# Altium project FPGA.PrjPCB
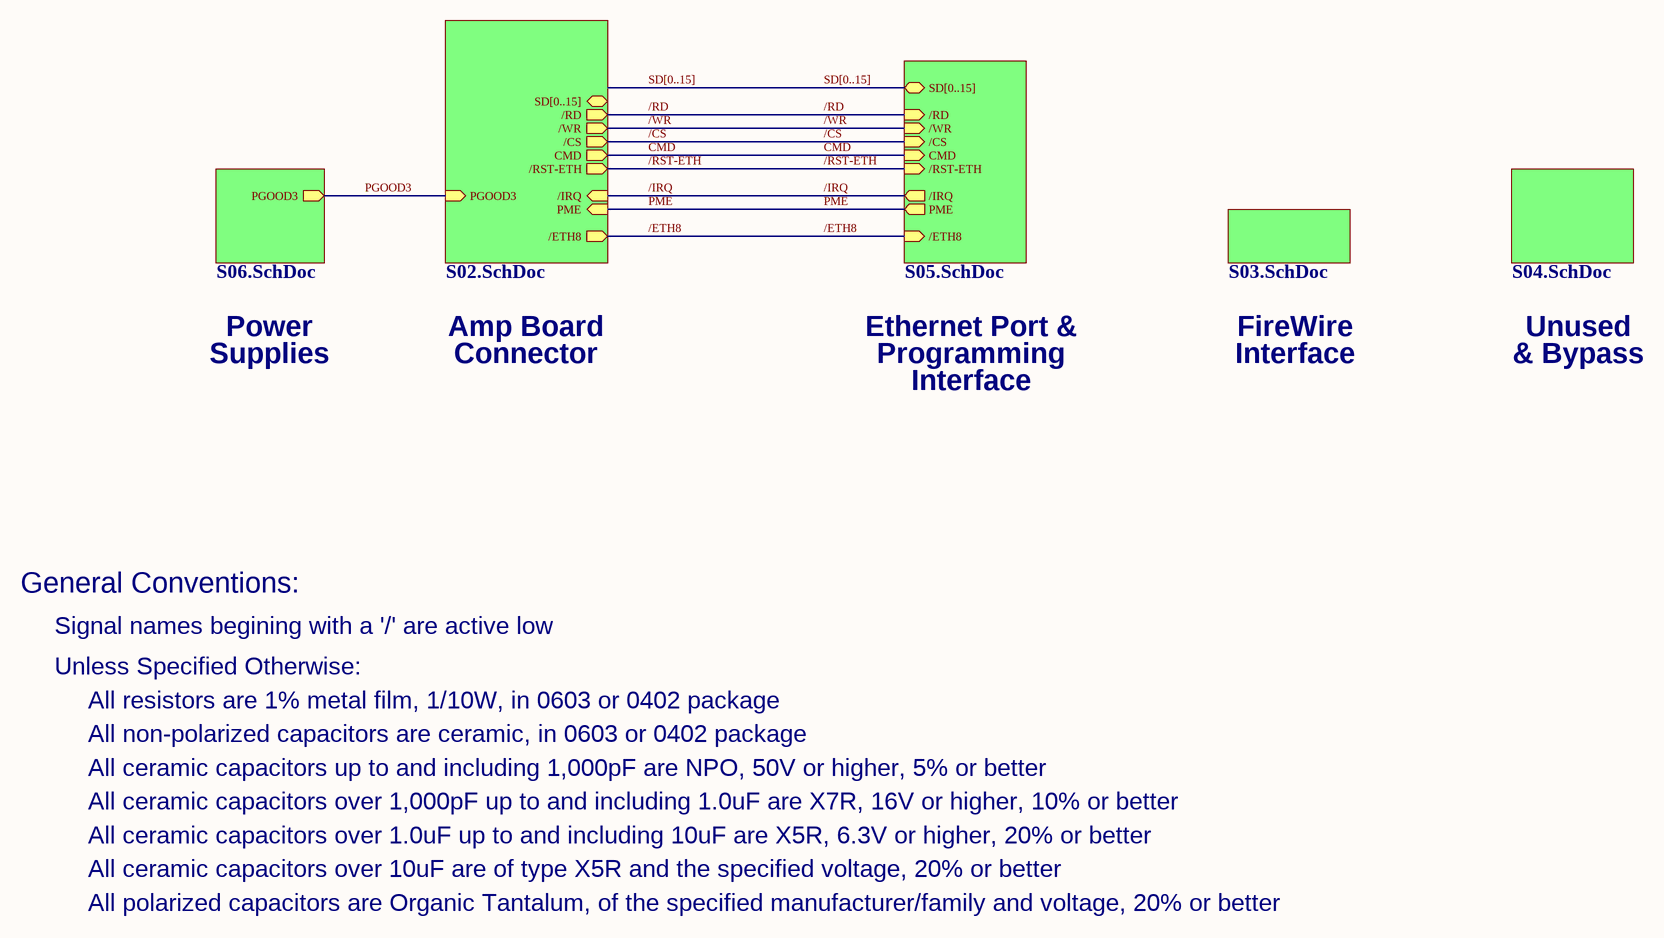
[diagram p0: S01.SchDoc]
6 sheets, 235 parts. Net scope: flat (ports and power ports of the same name join across sheets).
Board file: FPGA.PcbDoc
Sheets:
  S01.SchDoc
    U_S02 = S02.SchDoc
    U_S03 = S03.SchDoc
    U_S04 = S04.SchDoc
    U_S05 = S05.SchDoc
    U_S06 = S06.SchDoc

## Sheet S01.SchDoc: IEEE-1394/Ethernet FPGA Controller
size 381 x 254 mm; Revision: 2.1; SheetNumber: 1; SheetTotal: 6; PageSetup: Record=PageOptions|CenterHorizontal=True|CenterVertical=True|PrintScale=1.08|XCorrection=1.00|YCorrection=1.00|PrintKind=1|BorderSize=5000000|LeftOffset=0|BottomOffset=0|Orientation=2|PaperLength=1000|PaperWidth=1000|Scale=100|PaperSource=7|PrintQuality=600|MediaType=1|DitherType=10|PrintScaleMode=1|PaperKind=Ledger|PaperIndex=3

### Sub-sheets
U_S02 = S02.SchDoc: CMD (out), /IRQ (in), /RD (out), /WR (out), /CS (out), /RST-ETH (out), PME (in), SD[0..15] (bidir), PGOOD3 (in), /ETH8 (out)
U_S03 = S03.SchDoc: no entries
U_S04 = S04.SchDoc: no entries
U_S05 = S05.SchDoc: CMD (in), /IRQ (out), /RD (in), /WR (in), /CS (in), /RST-ETH (in), PME (out), SD[0..15] (bidir), /ETH8 (in)
U_S06 = S06.SchDoc: PGOOD3 (out)

### Nets
/CS: sheet U_S02//CS, sheet U_S05//CS
/ETH8: sheet U_S02//ETH8, sheet U_S05//ETH8
/IRQ: sheet U_S02//IRQ, sheet U_S05//IRQ
/RD: sheet U_S02//RD, sheet U_S05//RD
/RST-ETH: sheet U_S02//RST-ETH, sheet U_S05//RST-ETH
/WR: sheet U_S02//WR, sheet U_S05//WR
CMD: sheet U_S02/CMD, sheet U_S05/CMD
PGOOD3: sheet U_S02/PGOOD3, sheet U_S06/PGOOD3
PME: sheet U_S02/PME, sheet U_S05/PME

### Buses and harness runs
bus SD[0..15] = sheet U_S05/SD[0..15]

### Notes on the sheet
- Power
- Supplies
- Amp Board
- Connector
- Ethernet Port &
- Programming
- FireWire
- Interface
- Unused
- & Bypass
- General Conventions:
- Signal names begining with a '/' are active low
- Unless Specified Otherwise:
- All resistors are 1% metal film, 1/10W, in 0603 or 0402 package
- All non-polarized capacitors are ceramic, in 0603 or 0402 package
- All ceramic capacitors up to and including 1,000pF are NPO, 50V or higher, 5% or better
- All ceramic capacitors over 1,000pF up to and including 1.0uF are X7R, 16V or higher, 10% or better
- All ceramic capacitors over 10uF are of type X5R and the specified voltage, 20% or better
- All polarized capacitors are Organic Tantalum, of the specified manufacturer/family and voltage, 20% or better
- All ceramic capacitors over 1.0uF up to and including 10uF are X5R, 6.3V or higher, 20% or better
- 1
- 2
- 3
- 4
- 5
- A
- B
- C
- Drawing Title:
- D
- E
- Sheet:
- Rev:
- F
- Title:
- Computational
- Sensing + Robotics
- L A B O R A T O R Y   F O R
- Part No:
- Print Date:
- THE JOHNS HOPKINS UNIVERSITY
- h t t p : / / l c s r . j h u . e d u
- File Name:
- Sheet
- of

## Sheet S02.SchDoc: IEEE-1394/Ethernet FPGA Controller
size 381 x 254 mm; Revision: 2.1; SheetNumber: 2; SheetTotal: 6
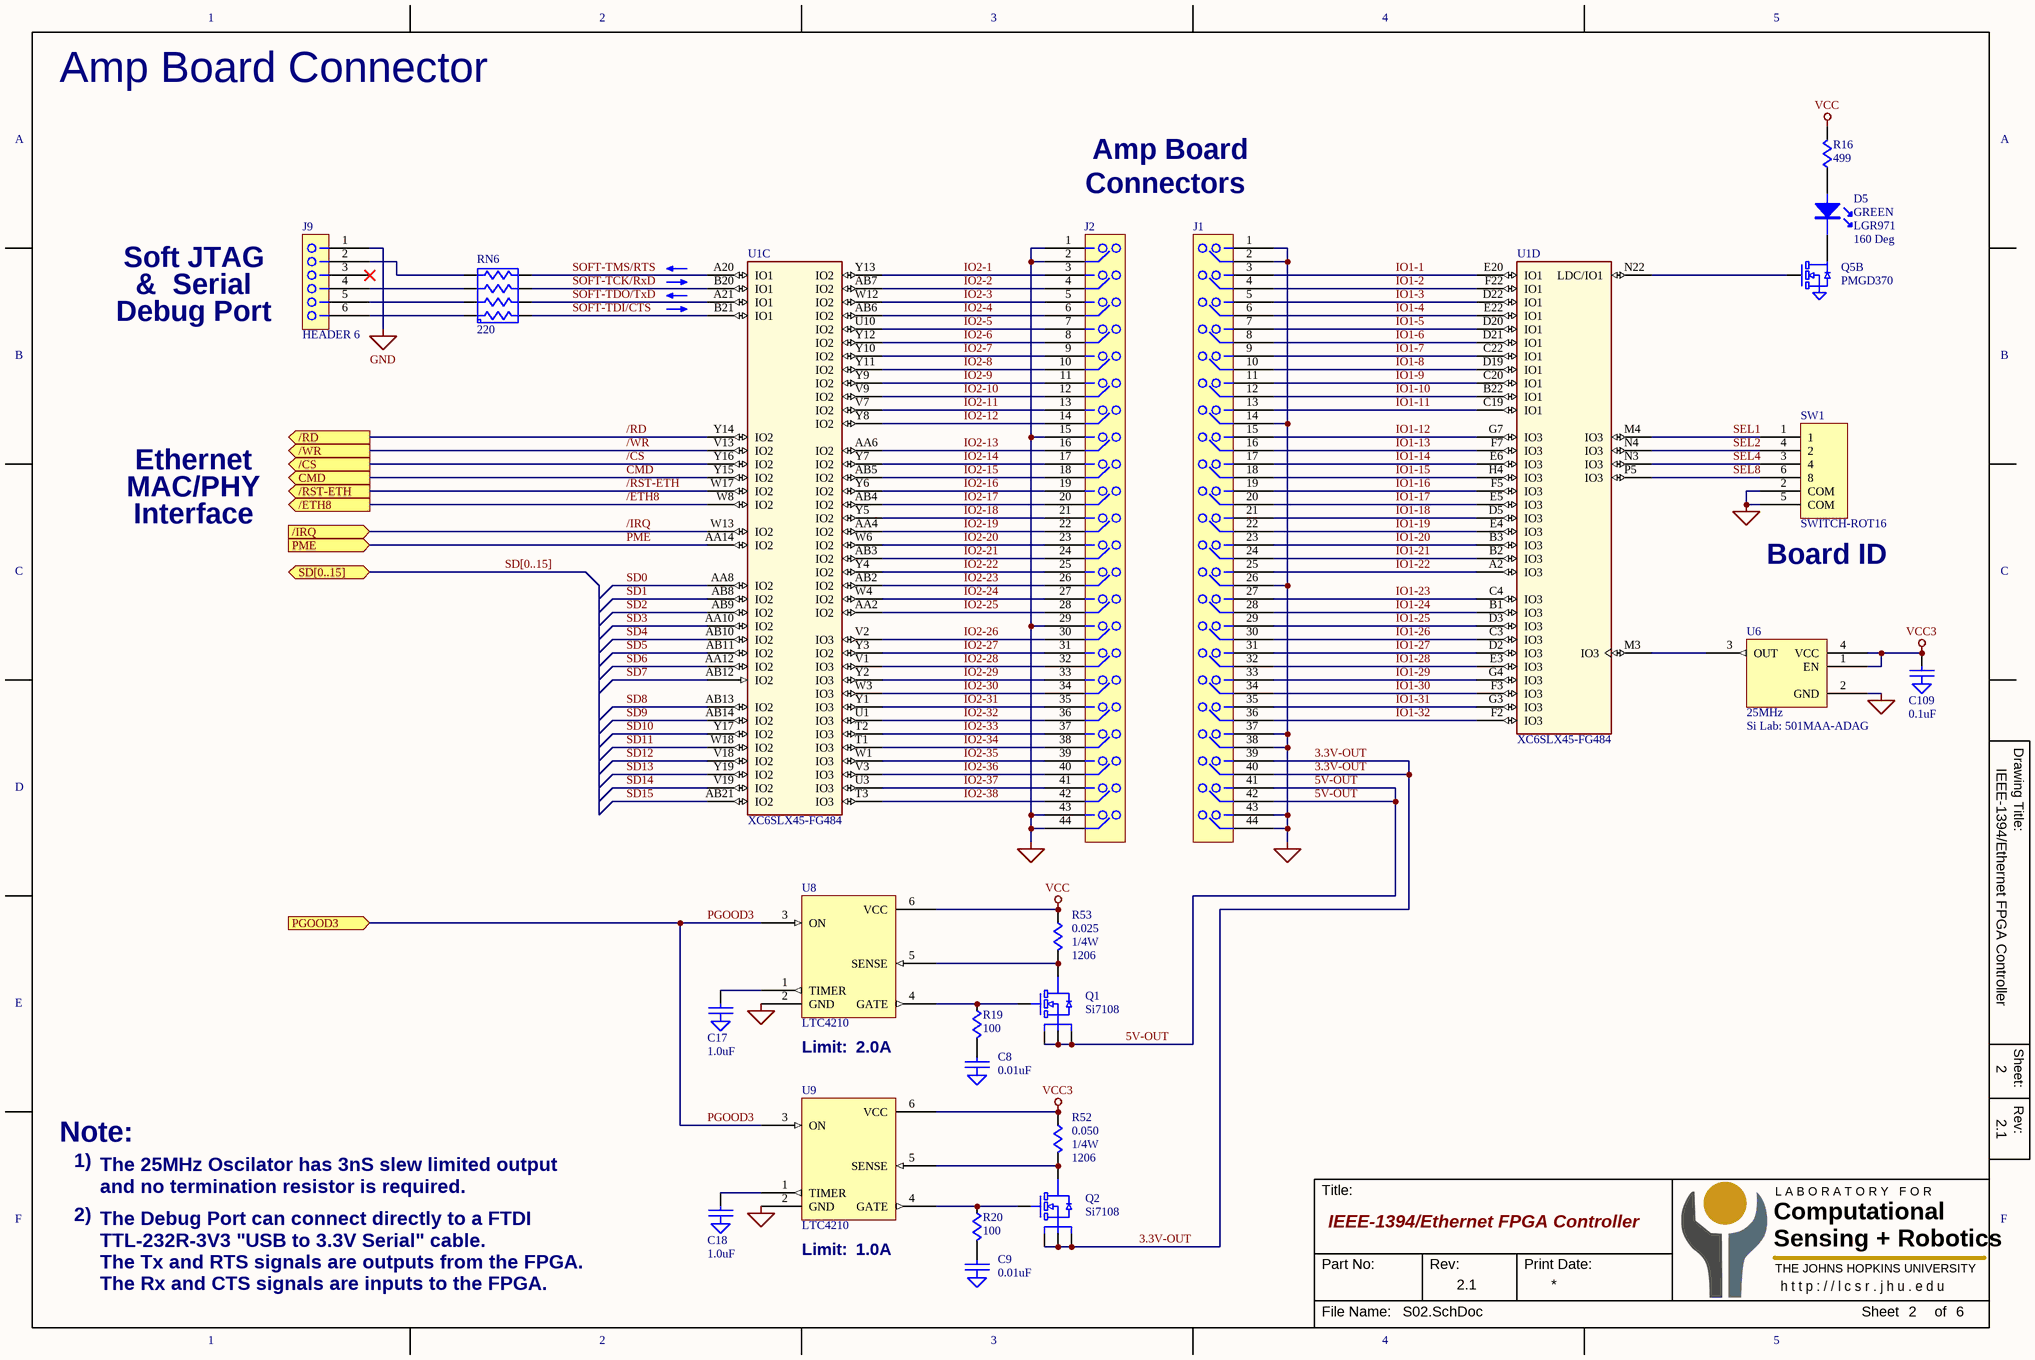
[diagram p1: S02.SchDoc]

### Parts
C8  0.01uF  [C0603]
C9  0.01uF  [C0603]
C17  1.0uF  [C0603]
C18  1.0uF  [C0603]
C109  0.1uF  [C0402]
D5  Color: GREEN  P/N: LGR971  Angle: 160 Deg  [LED-0805]  (hidden comment: LED)
J1  HEADER 22x2-1  [HDR-22x2-2MM]  (value not drawn)
J2  HEADER 22x2-1  [HDR-22x2-2MM]  (value not drawn)
J9  HEADER 6  [HDR-6x1-100]
Q1  Si7108  [PowerPak-1212]
Q2  Si7108  [PowerPak-1212]
Q5  PMGD370  [SC70-6]  (part B of 2)
R16  499  [R0603]
R19  100  [R0603]
R20  100  [R0603]
R52  0.050  Power: 1/4W  Type: 1206  [R1206]
R53  0.025  Power: 1/4W  Package: 1206  [R1206]
RN6  220  [RN-742C083]
SW1  SWITCH-ROT16  [SW-ROT-10MM-TH]
U1  XC6SLX45-FG484  [FG-484]  (parts C,D of 8)
U6  25MHz  [OSC-2x2.5mm]
U8  LTC4210  [SOT-23-6]
U9  LTC4210  [SOT-23-6]

### Ports
/CS (out), /ETH8 (out), /IRQ (in), /RD (out), /RST-ETH (out), /WR (out), CMD (out), PGOOD3 (in), PME (in), SD[0..15] (bidir)

### Nets
GND: C8.2(GND) C9.2(GND) C17.2(GND) C18.2(GND) C109.2(GND) J1.1 J1.2 J1.14 J1.26 J1.37 J1.38 J1.43 J1.44 J2.1 J2.2 J2.15 J2.29 J2.43 J2.44 J9.1 Q5.4(S2) SW1.2(COM) SW1.5(COM) U6.2(GND) U8.2(GND) U9.2(GND)
VCC: R16.2 R53.1 U8.6(VCC)
VCC3: C109.1 R52.1 U6.1(EN) U6.4(VCC) U9.6(VCC)
3.3V-OUT: J1.39 J1.40 Q2.1(S) Q2.2(S) Q2.3(S)
5V-OUT: J1.41 J1.42 Q1.1(S) Q1.2(S) Q1.3(S)
/CS: U1.Y16(IO2) ; port /CS
/ETH8: U1.W8(IO2) ; port /ETH8
/IRQ: U1.W13(IO2) ; port /IRQ
/RD: U1.Y14(IO2) ; port /RD
/RST-ETH: U1.W17(IO2) ; port /RST-ETH
/WR: U1.V13(IO2) ; port /WR
CMD: U1.Y15(IO2) ; port CMD
IO1-1: J1.3 U1.E20(IO1)
IO1-2: J1.4 U1.F22(IO1)
IO1-3: J1.5 U1.D22(IO1)
IO1-4: J1.6 U1.E22(IO1)
IO1-5: J1.7 U1.D20(IO1)
IO1-6: J1.8 U1.D21(IO1)
IO1-7: J1.9 U1.C22(IO1)
IO1-8: J1.10 U1.D19(IO1)
IO1-9: J1.11 U1.C20(IO1)
IO1-10: J1.12 U1.B22(IO1)
IO1-11: J1.13 U1.C19(IO1)
IO1-12: J1.15 U1.G7(IO3)
IO1-13: J1.16 U1.F7(IO3)
IO1-14: J1.17 U1.E6(IO3)
IO1-15: J1.18 U1.H4(IO3)
IO1-16: J1.19 U1.F5(IO3)
IO1-17: J1.20 U1.E5(IO3)
IO1-18: J1.21 U1.D5(IO3)
IO1-19: J1.22 U1.E4(IO3)
IO1-20: J1.23 U1.B3(IO3)
IO1-21: J1.24 U1.B2(IO3)
IO1-22: J1.25 U1.A2(IO3)
IO1-23: J1.27 U1.C4(IO3)
IO1-24: J1.28 U1.B1(IO3)
IO1-25: J1.29 U1.D3(IO3)
IO1-26: J1.30 U1.C3(IO3)
IO1-27: J1.31 U1.D2(IO3)
IO1-28: J1.32 U1.E3(IO3)
IO1-29: J1.33 U1.G4(IO3)
IO1-30: J1.34 U1.F3(IO3)
IO1-31: J1.35 U1.G3(IO3)
IO1-32: J1.36 U1.F2(IO3)
IO2-1: J2.3 U1.Y13(IO2)
IO2-2: J2.4 U1.AB7(IO2)
IO2-3: J2.5 U1.W12(IO2)
IO2-4: J2.6 U1.AB6(IO2)
IO2-5: J2.7 U1.U10(IO2)
IO2-6: J2.8 U1.Y12(IO2)
IO2-7: J2.9 U1.Y10(IO2)
IO2-8: J2.10 U1.Y11(IO2)
IO2-9: J2.11 U1.Y9(IO2)
IO2-10: J2.12 U1.V9(IO2)
IO2-11: J2.13 U1.V7(IO2)
IO2-12: J2.14 U1.Y8(IO2)
IO2-13: J2.16 U1.AA6(IO2)
IO2-14: J2.17 U1.Y7(IO2)
IO2-15: J2.18 U1.AB5(IO2)
IO2-16: J2.19 U1.Y6(IO2)
IO2-17: J2.20 U1.AB4(IO2)
IO2-18: J2.21 U1.Y5(IO2)
IO2-19: J2.22 U1.AA4(IO2)
IO2-20: J2.23 U1.W6(IO2)
IO2-21: J2.24 U1.AB3(IO2)
IO2-22: J2.25 U1.Y4(IO2)
IO2-23: J2.26 U1.AB2(IO2)
IO2-24: J2.27 U1.W4(IO2)
IO2-25: J2.28 U1.AA2(IO2)
IO2-26: J2.30 U1.V2(IO3)
IO2-27: J2.31 U1.Y3(IO2)
IO2-28: J2.32 U1.V1(IO3)
IO2-29: J2.33 U1.Y2(IO3)
IO2-30: J2.34 U1.W3(IO3)
IO2-31: J2.35 U1.Y1(IO3)
IO2-32: J2.36 U1.U1(IO3)
IO2-33: J2.37 U1.T2(IO3)
IO2-34: J2.38 U1.T1(IO3)
IO2-35: J2.39 U1.W1(IO3)
IO2-36: J2.40 U1.V3(IO3)
IO2-37: J2.41 U1.U3(IO3)
IO2-38: J2.42 U1.T3(IO3)
PGOOD3: U8.3(ON) U9.3(ON) ; port PGOOD3
PME: U1.AA14(IO2) ; port PME
SD0: U1.AA8(IO2)
SD1: U1.AB8(IO2)
SD2: U1.AB9(IO2)
SD3: U1.AA10(IO2)
SD4: U1.AB10(IO2)
SD5: U1.AB11(IO2)
SD6: U1.AA12(IO2)
SD7: U1.AB12(IO2)
SD8: U1.AB13(IO2)
SD9: U1.AB14(IO2)
SD10: U1.Y17(IO2)
SD11: U1.W18(IO2)
SD12: U1.V18(IO2)
SD13: U1.Y19(IO2)
SD14: U1.V19(IO2)
SD15: U1.AB21(IO2)
SEL1: SW1.1 U1.M4(IO3)
SEL2: SW1.4(2) U1.N4(IO3)
SEL4: SW1.3(4) U1.N3(IO3)
SEL8: SW1.6(8) U1.P5(IO3)
SOFT-TCK/RxD: RN6.6(R3.2) U1.B20(IO1)
SOFT-TDI/CTS: RN6.8(R1.2) U1.B21(IO1)
SOFT-TDO/TxD: RN6.7(R2.2) U1.A21(IO1)
SOFT-TMS/RTS: RN6.5(R4.2) U1.A20(IO1)
NetC8_1: C8.1 R19.2
NetC9_1: C9.1 R20.2
NetC17_1: C17.1 U8.1(TIMER)
NetC18_1: C18.1 U9.1(TIMER)
NetD5_1: D5.1(C) Q5.3(D2)
NetD5_2: D5.2(A) R16.1
NetJ9_2: J9.2 RN6.4(R4.1)
NetJ9_4: J9.4 RN6.3(R3.1)
NetJ9_5: J9.5 RN6.2(R2.1)
NetJ9_6: J9.6 RN6.1(R1)
NetQ1_4: Q1.4(G) R19.1 U8.4(GATE)
NetQ1_5: Q1.5(D) R53.2 U8.5(SENSE)
NetQ2_4: Q2.4(G) R20.1 U9.4(GATE)
NetQ2_5: Q2.5(D) R52.2 U9.5(SENSE)
NetQ5_5: Q5.5(G2) U1.N22(LDC/IO1)
NetU1_M3: U1.M3(IO3) U6.3(OUT)

Not connected (* = marked no-connect by the designer): J9 3*

### Buses and harness runs
bus SD[0..15] = port SD[0..15]

### Notes on the sheet
- Amp Board Connector
- Amp Board
- Connectors
- Soft JTAG
- &  Serial
- Debug Port
- Ethernet
- MAC/PHY
- Interface
- (near SW1) Board ID
- Limit:
- 2.0A
- Note:
- 1)
- 2)
- The 25MHz Oscilator has 3nS slew limited output and no termination resistor is required.
- The Debug Port can connect directly to a FTDI TTL-232R-3V3 "USB to 3.3V Serial" cable.
  The Tx and RTS signals are outputs from the FPGA.
  The Rx and CTS signals are inputs to the FPGA.
- (near U9) Limit:
- (near U9) 1.0A
- 1
- 2
- 3
- 4
- 5
- A
- B
- C
- Drawing Title:
- D
- E
- Sheet:
- Rev:
- F
- Title:
- Computational
- Sensing + Robotics
- L A B O R A T O R Y   F O R
- Part No:
- Print Date:
- THE JOHNS HOPKINS UNIVERSITY
- h t t p : / / l c s r . j h u . e d u
- File Name:
- Sheet
- of
- (in symbol OSCILATOR) Si Lab: 501MAA-ADAG

### Library data of the parts
C8 C9 C17 C18 C109 = CAP-GND
Q1 Q2 = MOSFET-N-PPACK
Q5 = MOSFET-N-DUAL6
R16 R52 R53 = R
R19 R20 = R-MINI
RN6 = RN-DISC-SM-4
U6 = OSCILATOR

## Sheet S03.SchDoc: IEEE-1394/Ethernet FPGA Controller
size 381 x 254 mm; Revision: 2.1; SheetNumber: 3; SheetTotal: 6
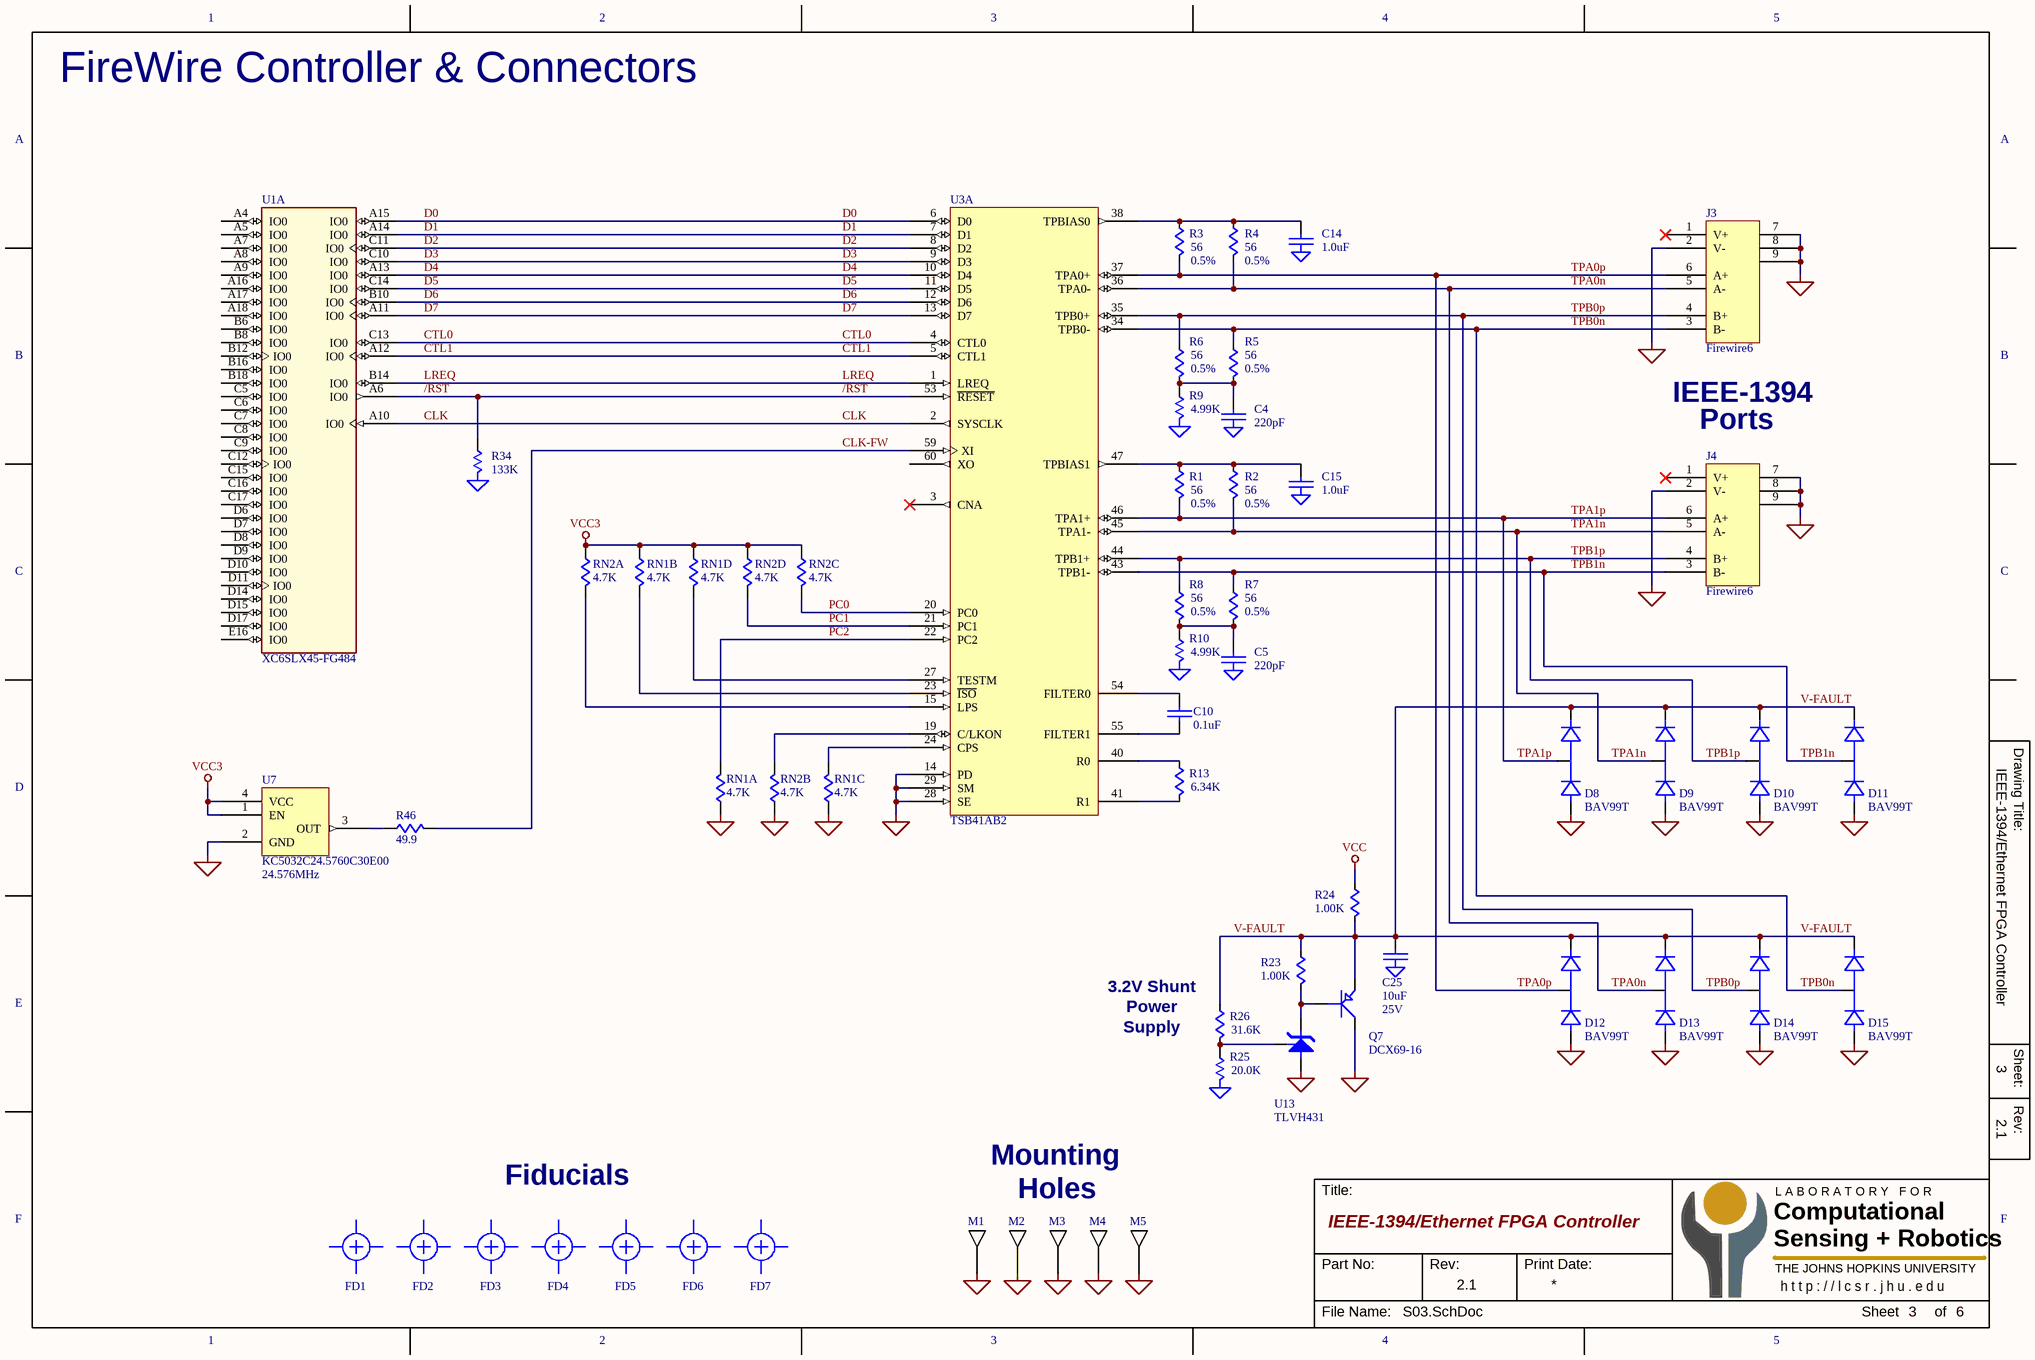
[diagram p2: S03.SchDoc]

### Parts
C4  220pF  [C0603]
C5  220pF  [C0603]
C10  0.1uF  [C0603]
C14  1.0uF  [C0603]
C15  1.0uF  [C0603]
C25  10uF  [C0805]
D8  BAV99T  [SOT-523]
D9  BAV99T  [SOT-523]
D10  BAV99T  [SOT-523]
D11  BAV99T  [SOT-523]
D12  BAV99T  [SOT-523]
D13  BAV99T  [SOT-523]
D14  BAV99T  [SOT-523]
D15  BAV99T  [SOT-523]
FD1  FD  [FD]  (value not drawn)
FD2  FD  [FD]  (value not drawn)
FD3  FD  [FD]  (value not drawn)
FD4  FD  [FD]  (value not drawn)
FD5  FD  [FD]  (value not drawn)
FD6  FD  [FD]  (value not drawn)
FD7  FD  [FD]  (value not drawn)
J3  Firewire6  [Firewire6-RA]
J4  Firewire6  [Firewire6-RA]
M1  MHOLE  [MHOLE4]  (value not drawn)  (no BOM)
M2  MHOLE  [MHOLE4]  (value not drawn)  (no BOM)
M3  MHOLE  [MHOLE4]  (value not drawn)  (no BOM)
M4  MHOLE  [MHOLE4]  (value not drawn)  (no BOM)
M5  MHOLE  [MHOLE4]  (value not drawn)  (no BOM)
Q7  DCX69-16  [SOT-89]
R1  56  Toll: 0.5%  [R0603]
R2  56  Toll: 0.5%  [R0603]
R3  56  Toll: 0.5%  [R0603]
R4  56  Toll: 0.5%  [R0603]
R5  56  Toll: 0.5%  [R0603]
R6  56  Toll: 0.5%  [R0603]
R7  56  Toll: 0.5%  [R0603]
R8  56  Toll: 0.5%  [R0603]
R9  4.99K  [R0603]
R10  4.99K  [R0603]
R13  6.34K  [R0603]
R23  1.00K  [R0603]
R24  1.00K  [R0603]
R25  20.0K  [R0603]
R26  31.6K  [R0603]
R34  133K  [R0603]
R46  49.9  [R0402]
RN1  4.7K  [RN-742C083]  (parts A,B,C,D of 4)
RN2  4.7K  [RN-742C083]  (parts A,B,C,D of 4)
U1  XC6SLX45-FG484  [FG-484]  (part A of 8)
U3  TSB41AB2  [PQFP-65]  (part A of 2)
U7  KC5032C24.5760C30E00  Freq: 24.576MHz  [OSC-3x5MM]
U13  TLVH431  [SC70-6]

### Nets
GND: C4.2(GND) C5.2(GND) C14.2(GND) C15.2(GND) C25.2(GND) D8.1(A) D9.1(A) D10.1(A) D11.1(A) D12.1(A) D13.1(A) D14.1(A) D15.1(A) J3.2(V-) J3.7(CHASIS) J3.8(CHASIS) J3.9(CHASIS) J4.2(V-) J4.7(CHASIS) J4.8(CHASIS) J4.9(CHASIS) M1.1 M2.1 M3.1 M4.1 M5.1 Q7.3(C) R9.2(GND) R10.2(GND) R25.2(GND) R34.2(GND) RN1.1 RN1.3 RN2.2 U3.14(PD) U3.28(SE) U3.29(SM) U7.2(GND) U13.6(A)
VCC: R24.1
VCC3: RN1.2 RN1.4 RN2.1 RN2.3 RN2.4 U7.1(EN) U7.4(VCC)
/RST: R34.1 U1.A6(IO0) U3.53(~{RESET})
CLK: U1.A10(IO0) U3.2(SYSCLK)
CLK-FW: R46.2 U3.59(XI)
CTL0: U1.C13(IO0) U3.4(CTL0)
CTL1: U1.A12(IO0) U3.5(CTL1)
D0: U1.A15(IO0) U3.6(D0)
D1: U1.A14(IO0) U3.7(D1)
D2: U1.C11(IO0) U3.8(D2)
D3: U1.C10(IO0) U3.9(D3)
D4: U1.A13(IO0) U3.10(D4)
D5: U1.C14(IO0) U3.11(D5)
D6: U1.B10(IO0) U3.12(D6)
D7: U1.A11(IO0) U3.13(D7)
LREQ: U1.B14(IO0) U3.1(LREQ)
PC0: RN2.6 U3.20(PC0)
PC1: RN2.5 U3.21(PC1)
PC2: RN1.8 U3.22(PC2)
TPA0n: D13.3(COM) J3.5(A-) R4.2 U3.36(TPA0-)
TPA0p: D12.3(COM) J3.6(A+) R3.2 U3.37(TPA0+)
TPA1n: D9.3(COM) J4.5(A-) R2.2 U3.45(TPA1-)
TPA1p: D8.3(COM) J4.6(A+) R1.2 U3.46(TPA1+)
TPB0n: D15.3(COM) J3.3(B-) R5.1 U3.34(TPB0-)
TPB0p: D14.3(COM) J3.4(B+) R6.1 U3.35(TPB0+)
TPB1n: D11.3(COM) J4.3(B-) R7.1 U3.43(TPB1-)
TPB1p: D10.3(COM) J4.4(B+) R8.1 U3.44(TPB1+)
V-FAULT: C25.1 D8.2(C) D9.2(C) D10.2(C) D11.2(C) D12.2(C) D13.2(C) D14.2(C) D15.2(C) Q7.2(E) R23.1 R24.2 R26.1
NetC4_1: C4.1 R5.2 R6.2 R9.1
NetC5_1: C5.1 R7.2 R8.2 R10.1
NetC10_1: C10.1 U3.54(FILTER0)
NetC10_2: C10.2 U3.55(FILTER1)
NetC14_1: C14.1 R3.1 R4.1 U3.38(TPBIAS0)
NetC15_1: C15.1 R1.1 R2.1 U3.47(TPBIAS1)
NetQ7_1: Q7.1(B) R23.2 U13.1(C)
NetR13_1: R13.1 U3.40(R0)
NetR13_2: R13.2 U3.41(R1)
NetR25_1: R25.1 R26.2 U13.3(ADJ)
NetR46_1: R46.1 U7.3(OUT)
NetRN1_5: RN1.5 U3.27(TESTM)
NetRN1_6: RN1.6 U3.24(CPS)
NetRN1_7: RN1.7 U3.23(~{ISO})
NetRN2_7: RN2.7 U3.19(C/LKON)
NetRN2_8: RN2.8 U3.15(LPS)

Not connected (* = marked no-connect by the designer): J3 1(V+)*; J4 1(V+)*; U1 A4(IO0) A5(IO0) A7(IO0) A8(IO0) A9(IO0) A16(IO0) A17(IO0) A18(IO0) B6(IO0) B8(IO0) B12(IO0) B16(IO0) B18(IO0) C5(IO0) C6(IO0) C7(IO0) C8(IO0) C9(IO0) C12(IO0) C15(IO0) C16(IO0) C17(IO0) D6(IO0) D7(IO0) D8(IO0) D9(IO0) D10(IO0) D11(IO0) D14(IO0) D15(IO0) D17(IO0) E16(IO0); U3 3(CNA)* 60(XO)

### Notes on the sheet
- FireWire Controller & Connectors
- IEEE-1394
- (near J4) Ports
- (near R26) 3.2V Shunt
- Power
- Supply
- Mounting
- Fiducials
- Holes
- 1
- 2
- 3
- 4
- 5
- A
- B
- C
- Drawing Title:
- D
- E
- Sheet:
- Rev:
- F
- Title:
- Computational
- Sensing + Robotics
- L A B O R A T O R Y   F O R
- Part No:
- Print Date:
- THE JOHNS HOPKINS UNIVERSITY
- h t t p : / / l c s r . j h u . e d u
- File Name:
- Sheet
- of
- (in symbol CAP-GND) 25V

### Library data of the parts
C4 C5 C14 C15 C25 = CAP-GND
C10 = CAP
D8-D15 = DIODE-2/SER
M1-M5 = MHOLE: Mounting Hole
Q7 = PNP-SM
R1-R8 R13 R23 R24 R26 = R-MINI
R9 R10 R25 R34 = R-GND
R46 = R
RN1 RN2 = RN-DISC-SM-4X
U3 = TSB41AB2: IEEE 1394a-2000 Two-port Transceiver/Arbiter
U7 = OSCILATOR
U13 = TLVH431-SC70

## Sheet S04.SchDoc: IEEE-1394/Ethernet FPGA Controller
size 381 x 254 mm; Revision: 2.1; SheetNumber: 4; SheetTotal: 6
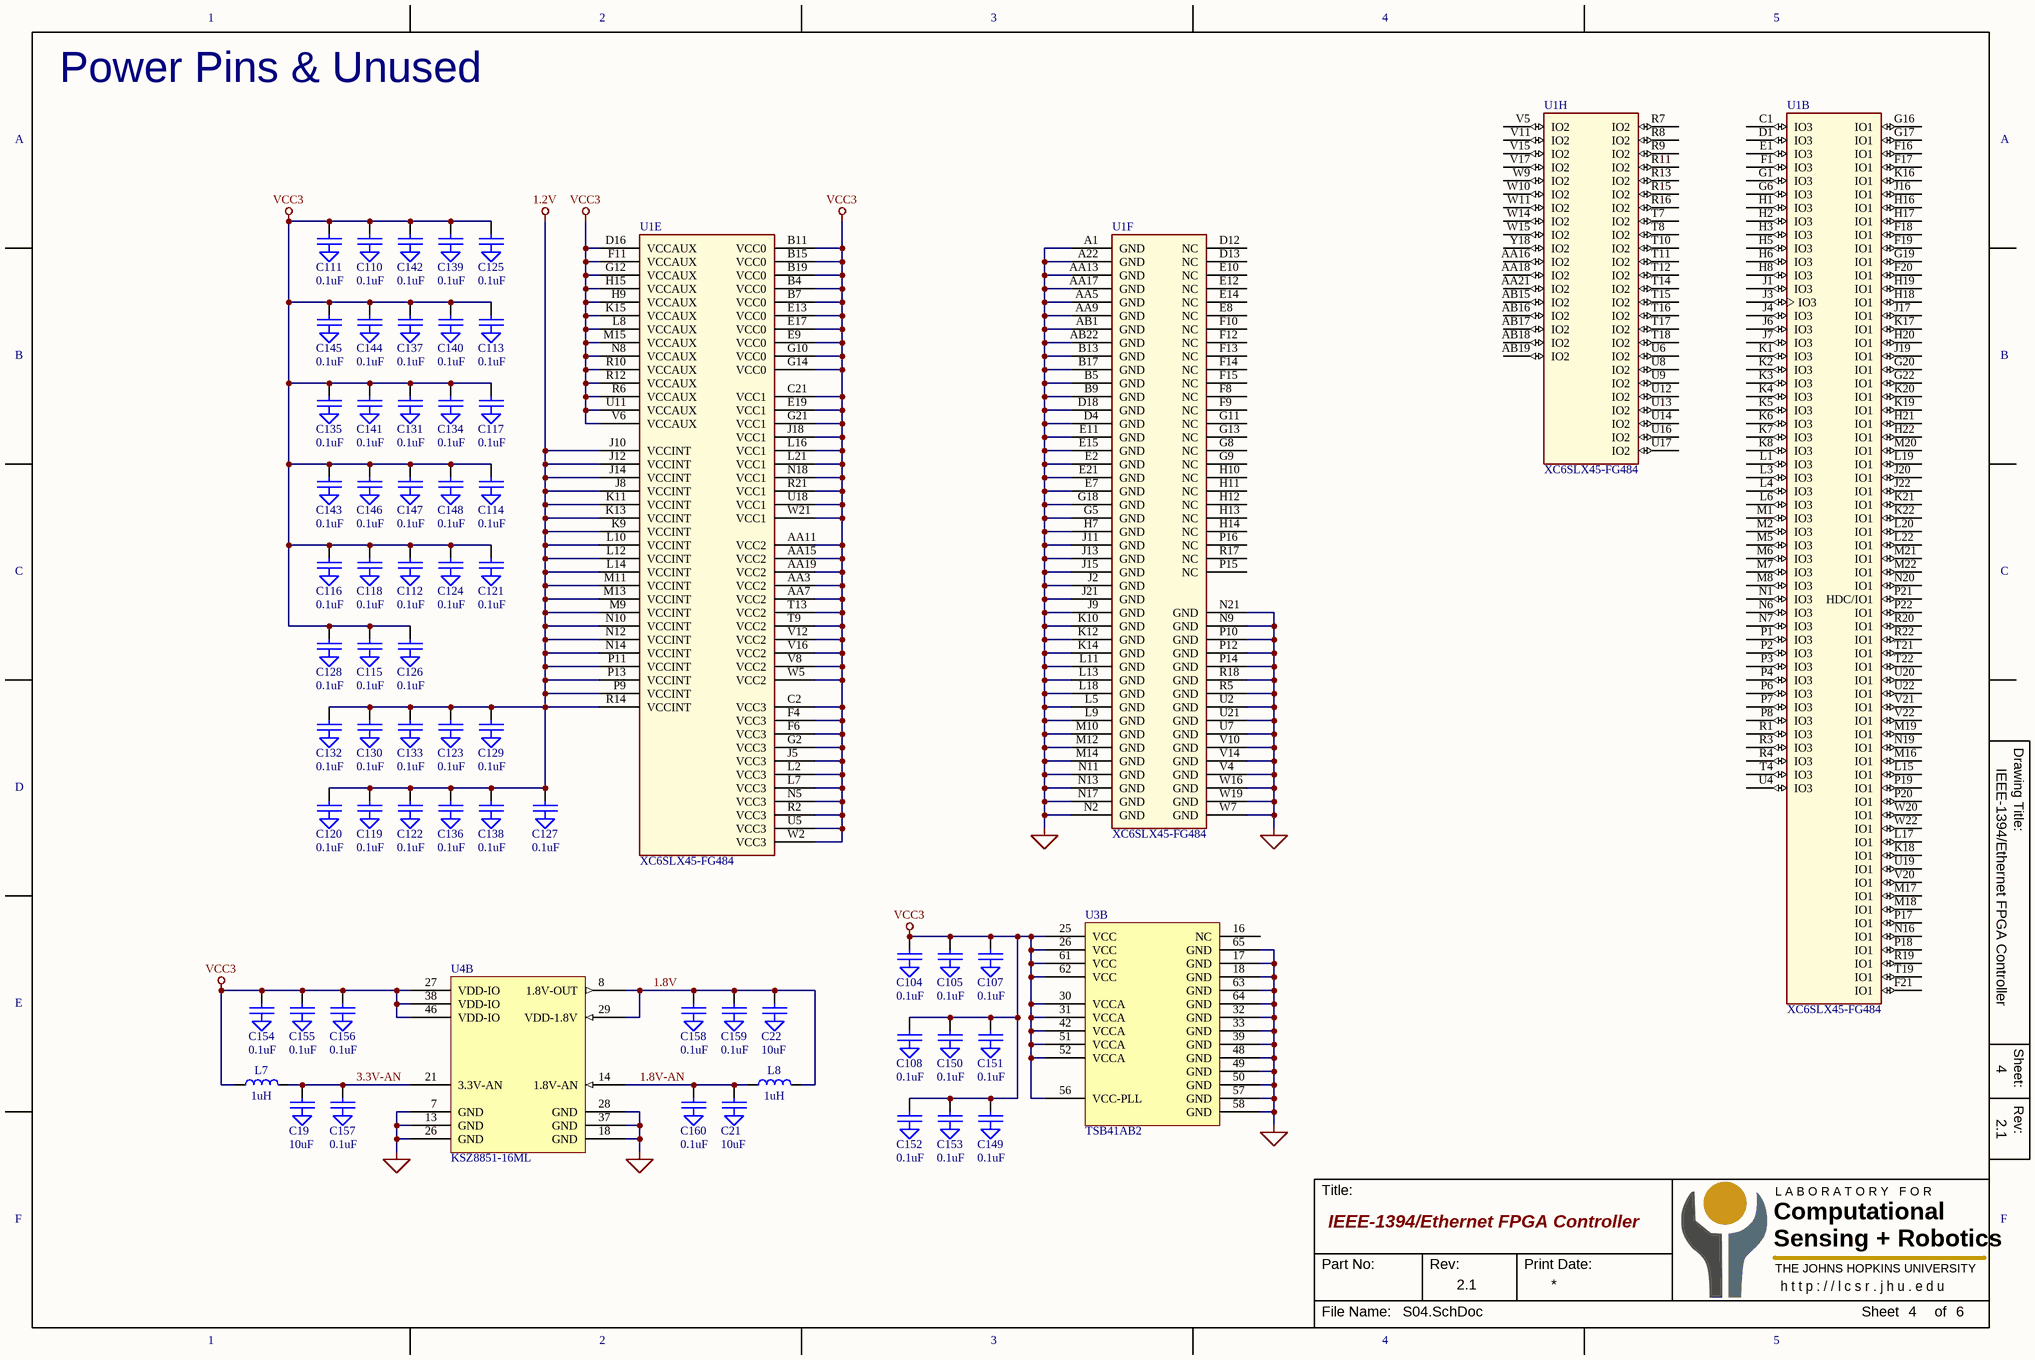
[diagram p3: S04.SchDoc]

### Parts
C19  10uF  [C0603]
C21  10uF  [C0603]
C22  10uF  [C0603]
C104  0.1uF  [C0402]
C105  0.1uF  [C0402]
C107  0.1uF  [C0402]
C108  0.1uF  [C0402]
C110  0.1uF  [C0402]
C111  0.1uF  [C0402]
C112  0.1uF  [C0402]
C113  0.1uF  [C0402]
C114  0.1uF  [C0402]
C115  0.1uF  [C0402]
C116  0.1uF  [C0402]
C117  0.1uF  [C0402]
C118  0.1uF  [C0402]
C119  0.1uF  [C0402]
C120  0.1uF  [C0402]
C121  0.1uF  [C0402]
C122  0.1uF  [C0402]
C123  0.1uF  [C0402]
C124  0.1uF  [C0402]
C125  0.1uF  [C0402]
C126  0.1uF  [C0402]
C127  0.1uF  [C0402]
C128  0.1uF  [C0402]
C129  0.1uF  [C0402]
C130  0.1uF  [C0402]
C131  0.1uF  [C0402]
C132  0.1uF  [C0402]
C133  0.1uF  [C0402]
C134  0.1uF  [C0402]
C135  0.1uF  [C0402]
C136  0.1uF  [C0402]
C137  0.1uF  [C0402]
C138  0.1uF  [C0402]
C139  0.1uF  [C0402]
C140  0.1uF  [C0402]
C141  0.1uF  [C0402]
C142  0.1uF  [C0402]
C143  0.1uF  [C0402]
C144  0.1uF  [C0402]
C145  0.1uF  [C0402]
C146  0.1uF  [C0402]
C147  0.1uF  [C0402]
C148  0.1uF  [C0402]
C149  0.1uF  [C0402]
C150  0.1uF  [C0402]
C151  0.1uF  [C0402]
C152  0.1uF  [C0402]
C153  0.1uF  [C0402]
C154  0.1uF  [C0402]
C155  0.1uF  [C0402]
C156  0.1uF  [C0402]
C157  0.1uF  [C0402]
C158  0.1uF  [C0402]
C159  0.1uF  [C0402]
C160  0.1uF  [C0402]
L7  1uH  [L0603]
L8  1uH  [L0603]
U1  XC6SLX45-FG484  [FG-484]  (parts B,E,F,H of 8)
U3  TSB41AB2  [PQFP-65]  (part B of 2)
U4  KSZ8851-16ML  [QFP-48-7MM]  (part B of 2)

### Nets
1.2V: C119.1 C120.1 C122.1 C123.1 C127.1 C129.1 C130.1 C132.1 C133.1 C136.1 C138.1 U1.J8(VCCINT) U1.J10(VCCINT) U1.J12(VCCINT) U1.J14(VCCINT) U1.K9(VCCINT) U1.K11(VCCINT) U1.K13(VCCINT) U1.L10(VCCINT) U1.L12(VCCINT) U1.L14(VCCINT) U1.M9(VCCINT) U1.M11(VCCINT) U1.M13(VCCINT) U1.N10(VCCINT) U1.N12(VCCINT) U1.N14(VCCINT) U1.P9(VCCINT) U1.P11(VCCINT) U1.P13(VCCINT) U1.R14(VCCINT)
GND: C19.2(GND) C21.2(GND) C22.2(GND) C104.2(GND) C105.2(GND) C107.2(GND) C108.2(GND) C110.2(GND) C111.2(GND) C112.2(GND) C113.2(GND) C114.2(GND) C115.2(GND) C116.2(GND) C117.2(GND) C118.2(GND) C119.2(GND) C120.2(GND) C121.2(GND) C122.2(GND) C123.2(GND) C124.2(GND) C125.2(GND) C126.2(GND) C127.2(GND) C128.2(GND) C129.2(GND) C130.2(GND) C131.2(GND) C132.2(GND) C133.2(GND) C134.2(GND) C135.2(GND) C136.2(GND) C137.2(GND) C138.2(GND) C139.2(GND) C140.2(GND) C141.2(GND) C142.2(GND) C143.2(GND) C144.2(GND) C145.2(GND) C146.2(GND) C147.2(GND) C148.2(GND) C149.2(GND) C150.2(GND) C151.2(GND) C152.2(GND) C153.2(GND) C154.2(GND) C155.2(GND) C156.2(GND) C157.2(GND) C158.2(GND) C159.2(GND) C160.2(GND) U1.A1(GND) U1.A22(GND) U1.AA5(GND) U1.AA9(GND) U1.AA13(GND) U1.AA17(GND) U1.AB1(GND) U1.AB22(GND) U1.B5(GND) U1.B9(GND) U1.B13(GND) U1.B17(GND) U1.D4(GND) U1.D18(GND) U1.E2(GND) U1.E7(GND) U1.E11(GND) U1.E15(GND) U1.E21(GND) U1.G5(GND) U1.G18(GND) U1.H7(GND) U1.J2(GND) U1.J9(GND) U1.J11(GND) U1.J13(GND) U1.J15(GND) U1.J21(GND) U1.K10(GND) U1.K12(GND) U1.K14(GND) U1.L5(GND) U1.L9(GND) U1.L11(GND) U1.L13(GND) U1.L18(GND) U1.M10(GND) U1.M12(GND) U1.M14(GND) U1.N2(GND) U1.N9(GND) U1.N11(GND) U1.N13(GND) U1.N17(GND) U1.N21(GND) U1.P10(GND) U1.P12(GND) U1.P14(GND) U1.R5(GND) U1.R18(GND) U1.U2(GND) U1.U7(GND) U1.U21(GND) U1.V4(GND) U1.V10(GND) U1.V14(GND) U1.W7(GND) U1.W16(GND) U1.W19(GND) U3.17(GND) U3.18(GND) U3.32(GND) U3.33(GND) U3.39(GND) U3.48(GND) U3.49(GND) U3.50(GND) U3.57(GND) U3.58(GND) U3.63(GND) U3.64(GND) U3.65(GND) U4.7(GND) U4.13(GND) U4.18(GND) U4.26(GND) U4.28(GND) U4.37(GND)
VCC3: C104.1 C105.1 C107.1 C108.1 C110.1 C111.1 C112.1 C113.1 C114.1 C115.1 C116.1 C117.1 C118.1 C121.1 C124.1 C125.1 C126.1 C128.1 C131.1 C134.1 C135.1 C137.1 C139.1 C140.1 C141.1 C142.1 C143.1 C144.1 C145.1 C146.1 C147.1 C148.1 C149.1 C150.1 C151.1 C152.1 C153.1 C154.1 C155.1 C156.1 L7.1 U1.AA3(VCC2) U1.AA7(VCC2) U1.AA11(VCC2) U1.AA15(VCC2) U1.AA19(VCC2) U1.B4(VCC0) U1.B7(VCC0) U1.B11(VCC0) U1.B15(VCC0) U1.B19(VCC0) U1.C2(VCC3) U1.C21(VCC1) U1.D16(VCCAUX) U1.E9(VCC0) U1.E13(VCC0) U1.E17(VCC0) U1.E19(VCC1) U1.F4(VCC3) U1.F6(VCC3) U1.F11(VCCAUX) U1.G2(VCC3) U1.G10(VCC0) U1.G12(VCCAUX) U1.G14(VCC0) U1.G21(VCC1) U1.H9(VCCAUX) U1.H15(VCCAUX) U1.J5(VCC3) U1.J18(VCC1) U1.K15(VCCAUX) U1.L2(VCC3) U1.L7(VCC3) U1.L8(VCCAUX) U1.L16(VCC1) U1.L21(VCC1) U1.M15(VCCAUX) U1.N5(VCC3) U1.N8(VCCAUX) U1.N18(VCC1) U1.R2(VCC3) U1.R6(VCCAUX) U1.R10(VCCAUX) U1.R12(VCCAUX) U1.R21(VCC1) U1.T9(VCC2) U1.T13(VCC2) U1.U5(VCC3) U1.U11(VCCAUX) U1.U18(VCC1) U1.V6(VCCAUX) U1.V8(VCC2) U1.V12(VCC2) U1.V16(VCC2) U1.W2(VCC3) U1.W5(VCC2) U1.W21(VCC1) U3.25(VCC) U3.26(VCC) U3.30(VCCA) U3.31(VCCA) U3.42(VCCA) U3.51(VCCA) U3.52(VCCA) U3.56(VCC-PLL) U3.61(VCC) U3.62(VCC) U4.27(VDD-IO) U4.38(VDD-IO) U4.46(VDD-IO)
1.8V: C22.1 C158.1 C159.1 L8.2 U4.8(1.8V-OUT) U4.29(VDD-1.8V)
1.8V-AN: C21.1 C160.1 L8.1 U4.14(1.8V-AN)
3.3V-AN: C19.1 C157.1 L7.2 U4.21(3.3V-AN)

Not connected (* = marked no-connect by the designer): U1 AA16(IO2) AA18(IO2) AA21(IO2) AB15(IO2) AB16(IO2) AB17(IO2) AB18(IO2) AB19(IO2) C1(IO3) D1(IO3) D12(NC) D13(NC) E1(IO3) E8(NC) E10(NC) E12(NC) E14(NC) F1(IO3) F8(NC) F9(NC) F10(NC) F12(NC) F13(NC) F14(NC) F15(NC) F16(IO1) F17(IO1) F18(IO1) F19(IO1) F20(IO1) F21(IO1) G1(IO3) G6(IO3) G8(NC) G9(NC) G11(NC) G13(NC) G16(IO1) G17(IO1) G19(IO1) G20(IO1) G22(IO1) H1(IO3) H2(IO3) H3(IO3) H5(IO3) H6(IO3) H8(IO3) H10(NC) H11(NC) H12(NC) H13(NC) H14(NC) H16(IO1) H17(IO1) H18(IO1) H19(IO1) H20(IO1) H21(IO1) H22(IO1) J1(IO3) J3(IO3) J4(IO3) J6(IO3) J7(IO3) J16(IO1) J17(IO1) J19(IO1) J20(IO1) J22(IO1) K1(IO3) K2(IO3) K3(IO3) K4(IO3) K5(IO3) K6(IO3) K7(IO3) K8(IO3) K16(IO1) K17(IO1) K18(IO1) K19(IO1) K20(IO1) K21(IO1) K22(IO1) L1(IO3) L3(IO3) L4(IO3) L6(IO3) L15(IO1) L17(IO1) L19(IO1) L20(IO1) L22(IO1) M1(IO3) M2(IO3) M5(IO3) M6(IO3) M7(IO3) M8(IO3) M16(IO1) M17(IO1) M18(IO1) M19(IO1) M20(IO1) M21(IO1) M22(IO1) N1(IO3) N6(IO3) N7(IO3) N16(IO1) N19(IO1) N20(IO1) P1(IO3) P2(IO3) P3(IO3) P4(IO3) P6(IO3) P7(IO3) P8(IO3) P15(NC) P16(NC) P17(IO1) P18(IO1) P19(IO1) P20(IO1) P21(HDC/IO1) P22(IO1) R1(IO3) R3(IO3) R4(IO3) R7(IO2) R8(IO2) R9(IO2) R11(IO2) R13(IO2) R15(IO2) R16(IO2) R17(NC) R19(IO1) R20(IO1) R22(IO1) T4(IO3) T7(IO2) T8(IO2) T10(IO2) T11(IO2) T12(IO2) T14(IO2) T15(IO2) T16(IO2) T17(IO2) T18(IO2) T19(IO1) T21(IO1) T22(IO1) U4(IO3) U6(IO2) U8(IO2) U9(IO2) U12(IO2) U13(IO2) U14(IO2) U16(IO2) U17(IO2) U19(IO1) U20(IO1) U22(IO1) V5(IO2) V11(IO2) V15(IO2) V17(IO2) V20(IO1) V21(IO1) V22(IO1) W9(IO2) W10(IO2) W11(IO2) W14(IO2) W15(IO2) W20(IO1) W22(IO1) Y18(IO2); U3 16(NC)

### Notes on the sheet
- Power Pins & Unused
- 1
- 2
- 3
- 4
- 5
- A
- B
- C
- Drawing Title:
- D
- E
- Sheet:
- Rev:
- F
- Title:
- Computational
- Sensing + Robotics
- L A B O R A T O R Y   F O R
- Part No:
- Print Date:
- THE JOHNS HOPKINS UNIVERSITY
- h t t p : / / l c s r . j h u . e d u
- File Name:
- Sheet
- of

### Library data of the parts
C19 C21 C22 C104 C105 C107 C108 C110-C160 = CAP-GND
L7 L8 = INDUCTOR
U3 = TSB41AB2: as U3 on sheet S03

## Sheet S05.SchDoc: IEEE-1394/Ethernet FPGA Controller
size 381 x 254 mm; Revision: 2.1; SheetNumber: 5; SheetTotal: 6
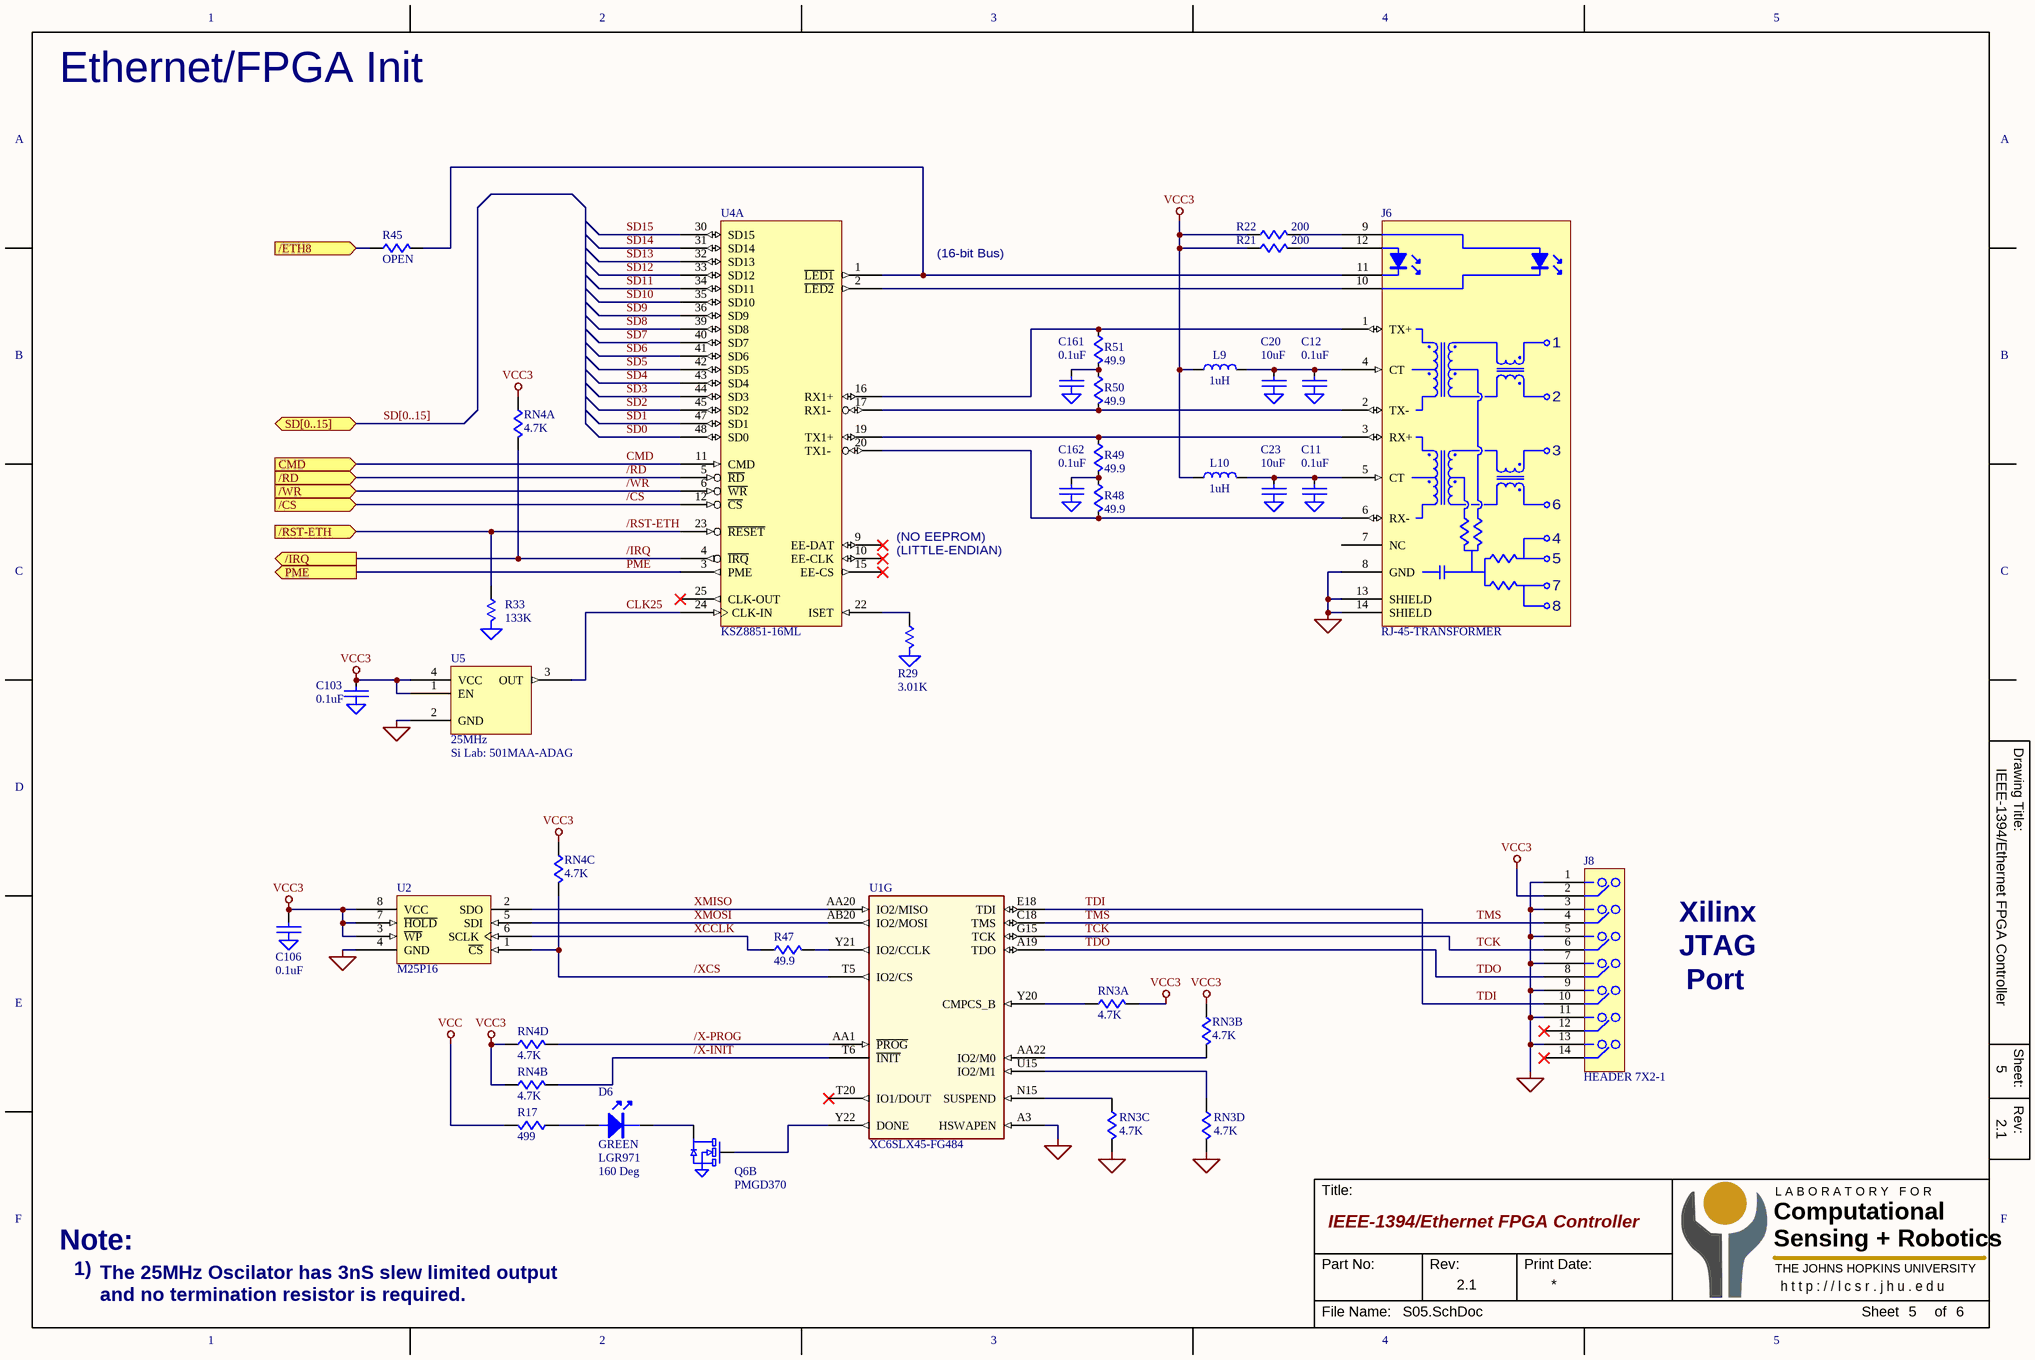
[diagram p4: S05.SchDoc]

### Parts
C11  0.1uF  [C0603]
C12  0.1uF  [C0603]
C20  10uF  [C0603]
C23  10uF  [C0603]
C103  0.1uF  [C0402]
C106  0.1uF  [C0402]
C161  0.1uF  [C0402]
C162  0.1uF  [C0402]
D6  Color: GREEN  P/N: LGR971  Angle: 160 Deg  [LED-0805]  (hidden comment: LED)
J6  RJ-45-TRANSFORMER  [RJ-45-TRANS]
J8  HEADER 7X2-1  [HDR-7x2-2MM]
L9  1uH  [L0603]
L10  1uH  [L0603]
Q6  PMGD370  [SC70-6]  (part B of 2)
R17  499  [R0603]
R21  200  [R0603]
R22  200  [R0603]
R29  3.01K  [R0603]
R33  133K  [R0603]
R45  OPEN  [R0603]
R47  49.9  [R0402]
R48  49.9  [R0402]
R49  49.9  [R0402]
R50  49.9  [R0402]
R51  49.9  [R0402]
RN3  4.7K  [RN-742C083]  (parts A,B,C,D of 4)
RN4  4.7K  [RN-742C083]  (parts A,B,C,D of 4)
U1  XC6SLX45-FG484  [FG-484]  (part G of 8)
U2  M25P16  [SO-8]
U4  KSZ8851-16ML  [QFP-48-7MM]  (part A of 2)
U5  25MHz  [OSC-2x2.5mm]

### Ports
/CS (in), /ETH8 (in), /IRQ (out), /RD (in), /RST-ETH (in), /WR (in), CMD (in), PME (out), SD[0..15] (bidir)

### Nets
GND: C11.2(GND) C12.2(GND) C20.2(GND) C23.2(GND) C103.2(GND) C106.2(GND) C161.2(GND) C162.2(GND) J6.8(GND) J6.13(SHIELD) J6.14(SHIELD) J8.1 J8.3 J8.5 J8.7 J8.9 J8.11 J8.13 Q6.4(S2) R29.2(GND) R33.2(GND) RN3.5 RN3.6 U1.A3(HSWAPEN) U2.4(GND) U5.2(GND)
VCC: R17.2
VCC3: C103.1 C106.1 J8.2 L9.1 L10.1 R21.1 R22.1 RN3.1 RN3.2 RN4.1 RN4.2 RN4.3 RN4.4 U2.3(~{WP}) U2.7(~{HOLD}) U2.8(VCC) U5.1(EN) U5.4(VCC)
/CS: U4.12(~{CS}) ; port /CS
/ETH8: R45.1 ; port /ETH8
/IRQ: RN4.8 U4.4(~{IRQ}) ; port /IRQ
/RD: U4.5(~{RD}) ; port /RD
/RST-ETH: R33.1 U4.23(~{RESET}) ; port /RST-ETH
/WR: U4.6(~{WR}) ; port /WR
/X-INIT: RN4.7 U1.T6(~{INIT})
/X-PROG: RN4.5 U1.AA1(~{PROG})
/XCS: RN4.6 U1.T5(IO2/CS) U2.1(~{CS})
CLK25: U4.24(CLK-IN) U5.3(OUT)
CMD: U4.11(CMD) ; port CMD
PME: U4.3(PME) ; port PME
SD0: U4.48(SD0)
SD1: U4.47(SD1)
SD2: U4.45(SD2)
SD3: U4.44(SD3)
SD4: U4.43(SD4)
SD5: U4.42(SD5)
SD6: U4.41(SD6)
SD7: U4.40(SD7)
SD8: U4.39(SD8)
SD9: U4.36(SD9)
SD10: U4.35(SD10)
SD11: U4.34(SD11)
SD12: U4.33(SD12)
SD13: U4.32(SD13)
SD14: U4.31(SD14)
SD15: U4.30(SD15)
TCK: J8.6 U1.G15(TCK)
TDI: J8.10 U1.E18(TDI)
TDO: J8.8 U1.A19(TDO)
TMS: J8.4 U1.C18(TMS)
XCCLK: R47.1 U2.6(SCLK)
XMISO: U1.AA20(IO2/MISO) U2.2(SDO)
XMOSI: U1.AB20(IO2/MOSI) U2.5(SDI)
NetC11_1: C11.1 C23.1 J6.5(CT) L10.2
NetC12_1: C12.1 C20.1 J6.4(CT) L9.2
NetC161_1: C161.1 R50.1 R51.2
NetC162_1: C162.1 R48.1 R49.2
NetD6_1: D6.1(C) Q6.3(D2)
NetD6_2: D6.2(A) R17.1
NetJ6_1: J6.1(TX+) R51.1 U4.16(RX1+)
NetJ6_2: J6.2(TX-) R50.2 U4.17(RX1-)
NetJ6_3: J6.3(RX+) R49.1 U4.19(TX1+)
NetJ6_6: J6.6(RX-) R48.2 U4.20(TX1-)
NetJ6_9: J6.9(A) R22.2
NetJ6_10: J6.10(K) U4.2(~{LED2})
NetJ6_11: J6.11(K) R45.2 U4.1(~{LED1})
NetJ6_12: J6.12(A) R21.2
NetQ6_5: Q6.5(G2) U1.Y22(DONE)
NetR29_1: R29.1 U4.22(ISET)
NetR47_2: R47.2 U1.Y21(IO2/CCLK)
NetRN3_3: RN3.3 U1.N15(SUSPEND)
NetRN3_4: RN3.4 U1.U15(IO2/M1)
NetRN3_7: RN3.7 U1.AA22(IO2/M0)
NetRN3_8: RN3.8 U1.Y20(CMPCS_B)

Not connected (* = marked no-connect by the designer): J6 7(NC); J8 12* 14*; U1 T20(IO1/DOUT)*; U4 9(EE-DAT)* 10(EE-CLK)* 15(EE-CS)* 25(CLK-OUT)*

### Buses and harness runs
bus SD[0..15] = port SD[0..15]

### Notes on the sheet
- Ethernet/FPGA Init
- (16-bit Bus)
- (LITTLE-ENDIAN)
- (NO EEPROM)
- Xilinx
- JTAG
- Port
- Note:
- 1)
- The 25MHz Oscilator has 3nS slew limited output and no termination resistor is required.
- 1
- 2
- 3
- 4
- 5
- A
- B
- C
- Drawing Title:
- D
- E
- Sheet:
- Rev:
- F
- Title:
- Computational
- Sensing + Robotics
- L A B O R A T O R Y   F O R
- Part No:
- Print Date:
- THE JOHNS HOPKINS UNIVERSITY
- h t t p : / / l c s r . j h u . e d u
- File Name:
- Sheet
- of
- (in symbol OSCILATOR) Si Lab: 501MAA-ADAG

### Library data of the parts
C11 C12 C20 C23 C103 C106 C161 C162 = CAP-GND
L9 L10 = INDUCTOR
Q6 = MOSFET-N-DUAL6
R17 R21 R22 R45 R47-R51 = R
R29 R33 = R-GND
RN3 RN4 = RN-DISC-SM-4X
U2 = 25AA128
U5 = OSCILATOR

## Sheet S06.SchDoc: IEEE-1394/Ethernet FPGA Controller
size 381 x 254 mm; Revision: 2.1; SheetNumber: 6; SheetTotal: 6
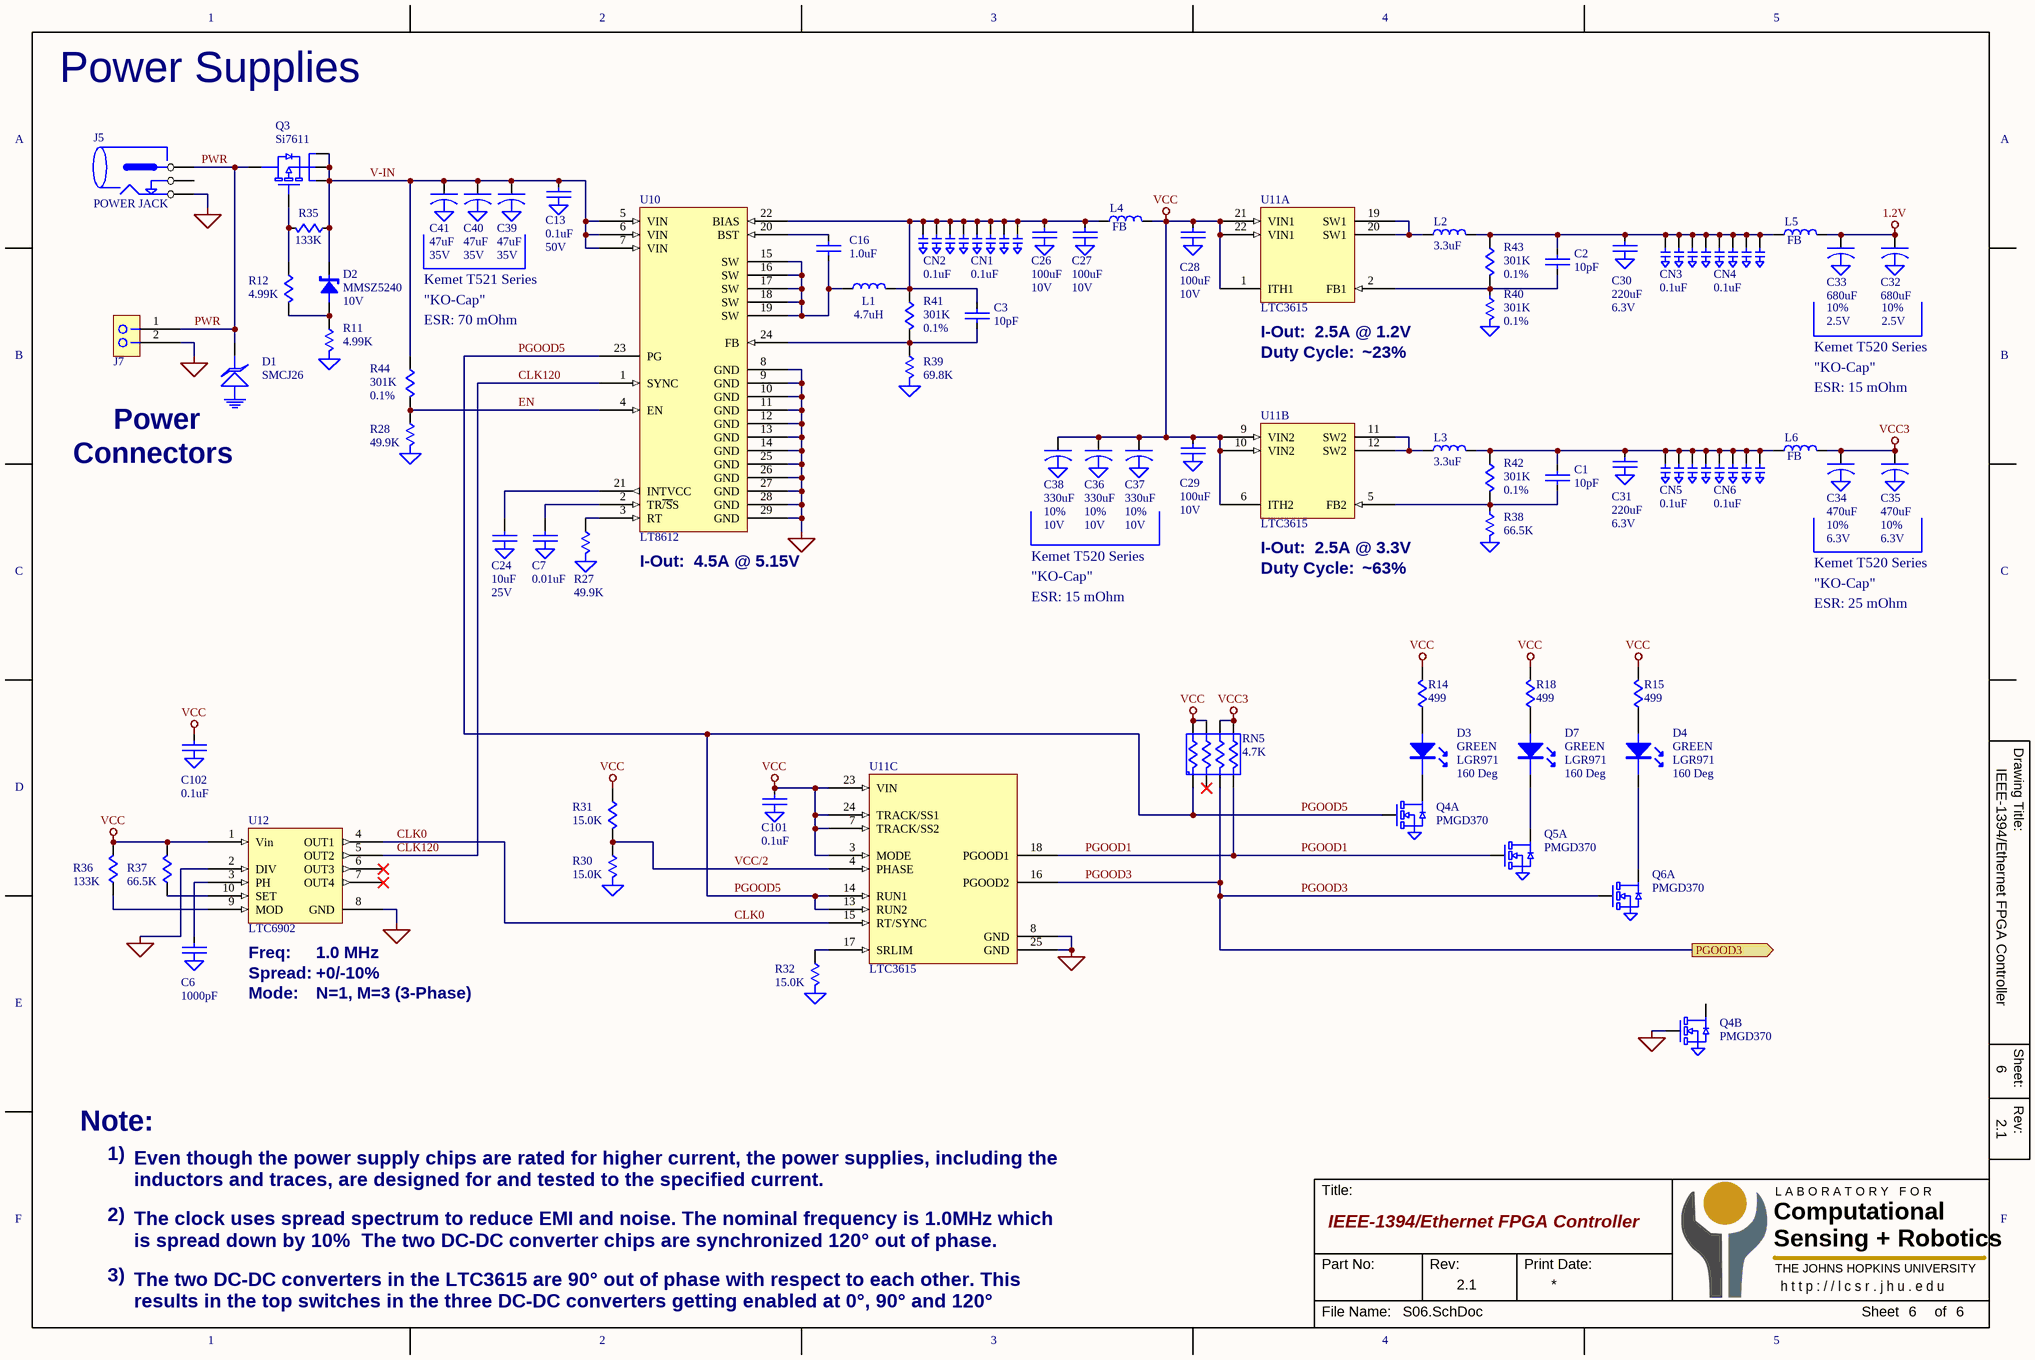
[diagram p5: S06.SchDoc]

### Parts
C1  10pF  [C0603]
C2  10pF  [C0603]
C3  10pF  [C0603]
C6  1000pF  [C0603]
C7  0.01uF  [C0603]
C13  0.1uF  Voltage: 50V  [C0603]
C16  1.0uF  [C0603]
C24  10uF  [C0805]
C26  100uF  Voltage: 10V  [C1210]
C27  100uF  Voltage: 10V  [C1210]
C28  100uF  [C1210]
C29  100uF  [C1210]
C30  220uF  Voltage: 6.3V  [C1210]
C31  220uF  Voltage: 6.3V  [C1210]
C32  680uF  Voltage: 2.5V  Tol: 10%  [CAP-D-31]
C33  680uF  Voltage: 2.5V  Tol: 10%  [CAP-D-31]
C34  470uF  Voltage: 6.3V  Tol: 10%  [CAP-D-31]
C35  470uF  Voltage: 6.3V  Tol: 10%  [CAP-D-31]
C36  330uF  Voltage: 10V  Tol: 10%  [CAP-D-31]
C37  330uF  Voltage: 10V  Tol: 10%  [CAP-D-31]
C38  330uF  Voltage: 10V  Tol: 10%  [CAP-D-31]
C39  47uF  Voltage: 35V  [CAP-D-31]
C40  47uF  Voltage: 35V  [CAP-D-31]
C41  47uF  Voltage: 35V  [CAP-D-31]
C101  0.1uF  [C0402]
C102  0.1uF  [C0402]
CN1  0.1uF  [CN0805]
CN2  0.1uF  [CN0805]
CN3  0.1uF  [CN0805]
CN4  0.1uF  [CN0805]
CN5  0.1uF  [CN0805]
CN6  0.1uF  [CN0805]
D1  SMCJ26  [DIODE-SMC]
D2  MMSZ5240  [SOD-323]
D3  Color: GREEN  P/N: LGR971  Angle: 160 Deg  [LED-0805]  (hidden comment: LED)
D4  Color: GREEN  P/N: LGR971  Angle: 160 Deg  [LED-0805]  (hidden comment: LED)
D7  Color: GREEN  P/N: LGR971  Angle: 160 Deg  [LED-0805]  (hidden comment: LED)
J5  POWER JACK  [RAPC712]
J7  HEADER 2  [HDR-2x1-100]  (value not drawn)
L1  4.7uH  [INDUCTOR-XAL7030]
L2  3.3uF  [INDUCTOR-XAL4040]
L3  3.3uF  [INDUCTOR-XAL4040]
L4  FB  [R1206]
L5  FB  [R1206]
L6  FB  [R1206]
Q3  Si7611  [PowerPak-1212]
Q4  PMGD370  [SC70-6]  (parts A,B of 2)
Q5  PMGD370  [SC70-6]  (part A of 2)
Q6  PMGD370  [SC70-6]  (part A of 2)
R11  4.99K  [R0603]
R12  4.99K  [R0603]
R14  499  [R0603]
R15  499  [R0603]
R18  499  [R0603]
R27  49.9K  [R0603]
R28  49.9K  [R0603]
R30  15.0K  [R0603]
R31  15.0K  [R0603]
R32  15.0K  [R0603]
R35  133K  [R0603]
R36  133K  [R0603]
R37  66.5K  [R0603]
R38  66.5K  [R0603]
R39  69.8K  [R0603]
R40  301K  [R0603]
R41  301K  [R0603]
R42  301K  [R0603]
R43  301K  [R0603]
R44  301K  [R0603]
RN5  4.7K  [RN-742C083]
U10  LT8612  [QFN-28-3x6mm]
U11  LTC3615  [QFN-24-4mm]  (parts A,B,C of 3)
U12  LTC6902  [MSOP-10]

### Ports
PGOOD3 (out)

### Nets
1.2V: C32.1 C33.1 L5.2
GND: C6.2(GND) C7.2(GND) C13.2(GND) C24.2(GND) C26.2(GND) C27.2(GND) C28.2(GND) C29.2(GND) C30.2(GND) C31.2(GND) C32.2(GND) C33.2(GND) C34.2(GND) C35.2(GND) C36.2(GND) C37.2(GND) C38.2(GND) C39.2(GND) C40.2(GND) C41.2(GND) C101.2(GND) C102.2(GND) CN1.1(GND) CN1.2(GND) CN1.3(GND) CN1.4(GND) CN2.1(GND) CN2.2(GND) CN2.3(GND) CN2.4(GND) CN3.1(GND) CN3.2(GND) CN3.3(GND) CN3.4(GND) CN4.1(GND) CN4.2(GND) CN4.3(GND) CN4.4(GND) CN5.1(GND) CN5.2(GND) CN5.3(GND) CN5.4(GND) CN6.1(GND) CN6.2(GND) CN6.3(GND) CN6.4(GND) D1.2(GND) J5.3 J7.2 Q4.1(S1) Q4.4(S2) Q4.5(G2) Q5.1(S1) Q6.1(S1) R11.2(GND) R27.2(GND) R28.2(GND) R30.2(GND) R32.2(GND) R38.2(GND) R39.2(GND) R40.2(GND) U10.8(GND) U10.9(GND) U10.10(GND) U10.11(GND) U10.12(GND) U10.13(GND) U10.14(GND) U10.25(GND) U10.26(GND) U10.27(GND) U10.28(GND) U10.29(GND) U11.8(GND) U11.25(GND) U12.2(DIV) U12.8(GND)
VCC: C28.1 C29.1 C36.1 C37.1 C38.1 C101.1 C102.1 L4.2 R14.2 R15.2 R18.2 R31.1 R36.2 R37.2 RN5.7(R2.2) RN5.8(R1.2) U11.1(ITH1) U11.3(MODE) U11.6(ITH2) U11.7(TRACK/SS2) U11.9(VIN2) U11.10(VIN2) U11.21(VIN1) U11.22(VIN1) U11.23(VIN) U11.24(TRACK/SS1) U12.1(Vin)
VCC3: C34.1 C35.1 L6.2 RN5.5(R4.2) RN5.6(R3.2)
CLK0: U11.15(RT/SYNC) U12.4(OUT1)
CLK120: U10.1(SYNC) U12.5(OUT2)
EN: R28.1 R44.2 U10.4(EN)
PGOOD1: Q5.2(G1) RN5.4(R4.1) U11.18(PGOOD1)
PGOOD3: Q6.2(G1) RN5.3(R3.1) U11.16(PGOOD2) ; port PGOOD3
PGOOD5: Q4.2(G1) RN5.1(R1) U10.23(PG) U11.13(RUN2) U11.14(RUN1)
PWR: D1.1 J5.1 J7.1 Q3.5(D)
V-IN: C13.1 C39.1 C40.1 C41.1 D2.1(C) Q3.1(S) Q3.2(S) Q3.3(S) R35.1 R44.1 U10.5(VIN) U10.6(VIN) U10.7(VIN)
VCC/2: R30.1 R31.2 U11.4(PHASE)
NetC1_1: C1.1 C31.1 CN5.5 CN5.6 CN5.7 CN5.8 CN6.5 CN6.6 CN6.7 CN6.8 L3.2 L6.1 R42.1
NetC1_2: C1.2 R38.1 R42.2 U11.5(FB2)
NetC2_1: C2.1 C30.1 CN3.5 CN3.6 CN3.7 CN3.8 CN4.5 CN4.6 CN4.7 CN4.8 L2.2 L5.1 R43.1
NetC2_2: C2.2 R40.1 R43.2 U11.2(FB1)
NetC3_1: C3.1 C26.1 C27.1 CN1.5 CN1.6 CN1.7 CN1.8 CN2.5 CN2.6 CN2.7 CN2.8 L1.2 L4.1 R41.1 U10.22(BIAS)
NetC3_2: C3.2 R39.1 R41.2 U10.24(FB)
NetC6_1: C6.1 U12.3(PH)
NetC7_1: C7.1 U10.2(TR~{/S}S)
NetC16_1: C16.1 U10.20(BST)
NetC16_2: C16.2 L1.1 U10.15(SW) U10.16(SW) U10.17(SW) U10.18(SW) U10.19(SW)
NetC24_1: C24.1 U10.21(INTVCC)
NetD2_2: D2.2(GND) R11.1 R12.2
NetD3_1: D3.1(C) Q4.6(D1)
NetD3_2: D3.2(A) R14.1
NetD4_1: D4.1(C) Q6.6(D1)
NetD4_2: D4.2(A) R15.1
NetD7_1: D7.1(C) Q5.6(D1)
NetD7_2: D7.2(A) R18.1
NetL2_1: L2.1 U11.19(SW1) U11.20(SW1)
NetL3_1: L3.1 U11.11(SW2) U11.12(SW2)
NetQ3_4: Q3.4(G) R12.1 R35.2
NetR27_1: R27.1 U10.3(RT)
NetR32_1: R32.1 U11.17(SRLIM)
NetR36_1: R36.1 U12.9(MOD)
NetR37_1: R37.1 U12.10(SET)

Not connected (* = marked no-connect by the designer): J5 2; Q4 3(D2); RN5 2(R2.1)*; U12 6(OUT3)* 7(OUT4)*

### Notes on the sheet
- Power Supplies
- Kemet T521 Series
- "KO-Cap"
- (near R44) ESR: 70 mOhm
- Duty Cycle:
- (near U11) I-Out:
- (near U11) 2.5A @ 1.2V
- ~23%
- Kemet T520 Series
- Power
- ESR: 15 mOhm
- Connectors
- (near U10) I-Out:
- (near U10) 4.5A @ 5.15V
- (near U11) 2.5A @ 3.3V
- ~63%
- ESR: 25 mOhm
- Freq:
- Spread:
- (near U12) 1.0 MHz
- +0/-10%
- Mode:
- N=1, M=3 (3-Phase)
- Note:
- 1)
- 2)
- Even though the power supply chips are rated for higher current, the power supplies, including the inductors and traces, are designed for and tested to the specified current.
- The clock uses spread spectrum to reduce EMI and noise. The nominal frequency is 1.0MHz which is spread down by 10%  The two DC-DC converter chips are synchronized 120° out of phase.
- 3)
- The two DC-DC converters in the LTC3615 are 90° out of phase with respect to each other. This results in the top switches in the three DC-DC converters getting enabled at 0°, 90° and 120°
- 1
- 2
- 3
- 4
- 5
- A
- B
- C
- Drawing Title:
- D
- E
- Sheet:
- Rev:
- F
- Title:
- Computational
- Sensing + Robotics
- L A B O R A T O R Y   F O R
- Part No:
- Print Date:
- THE JOHNS HOPKINS UNIVERSITY
- h t t p : / / l c s r . j h u . e d u
- File Name:
- Sheet
- of
- (in symbol CAP-GND) 25V; 10V
- (in symbol R) 0.1%
- (in symbol R-GND) 0.1%
- (in symbol ZENER) 10V

### Library data of the parts
C1-C3 C16 = CAP
C6 C7 C13 C24 C26-C31 C101 C102 = CAP-GND
C32-C35 = CAP-POL-GND: Type: KO-Cap
C36-C38 = CAP-POL-GND: Type: SpeedPower
C39-C41 = CAP-POL-GND: Type: Tant
CN1-CN6 = CN-GND
D1 = TVS-GND
D2 = ZENER
L1-L6 = INDUCTOR
Q3 = MOSFET-P-PPACK
Q4-Q6 = MOSFET-N-DUAL6
R11 R27 R28 R30 R32 R38-R40 = R-GND
R12 R14 R15 R18 R31 R35-R37 R41-R44 = R
RN5 = RN-DISC-SM-4

## Nets that join several sheets
1.2V: S04 (31 pins), S06 (C32.1 C33.1 L5.2)
GND: S02 (26 pins), S03 (39 pins), S04 (136 pins), S05 (26 pins), S06 (78 pins)
VCC: S02 (R16.2 R53.1 U8.6), S03 (R24.1), S05 (R17.2), S06 (27 pins)
VCC3: S02 (5 pins), S03 (7 pins), S04 (110 pins), S05 (18 pins), S06 (5 pins)
/CS: S02 (U1.Y16), S05 (U4.12)
/ETH8: S02 (U1.W8), S05 (R45.1)
/IRQ: S02 (U1.W13), S05 (RN4.8 U4.4)
/RD: S02 (U1.Y14), S05 (U4.5)
/RST-ETH: S02 (U1.W17), S05 (R33.1 U4.23)
/WR: S02 (U1.V13), S05 (U4.6)
CMD: S02 (U1.Y15), S05 (U4.11)
PGOOD3: S02 (U8.3 U9.3), S06 (Q6.2 RN5.3 U11.16)
PME: S02 (U1.AA14), S05 (U4.3)
SD0: S02 (U1.AA8), S05 (U4.48)
SD1: S02 (U1.AB8), S05 (U4.47)
SD2: S02 (U1.AB9), S05 (U4.45)
SD3: S02 (U1.AA10), S05 (U4.44)
SD4: S02 (U1.AB10), S05 (U4.43)
SD5: S02 (U1.AB11), S05 (U4.42)
SD6: S02 (U1.AA12), S05 (U4.41)
SD7: S02 (U1.AB12), S05 (U4.40)
SD8: S02 (U1.AB13), S05 (U4.39)
SD9: S02 (U1.AB14), S05 (U4.36)
SD10: S02 (U1.Y17), S05 (U4.35)
SD11: S02 (U1.W18), S05 (U4.34)
SD12: S02 (U1.V18), S05 (U4.33)
SD13: S02 (U1.Y19), S05 (U4.32)
SD14: S02 (U1.V19), S05 (U4.31)
SD15: S02 (U1.AB21), S05 (U4.30)